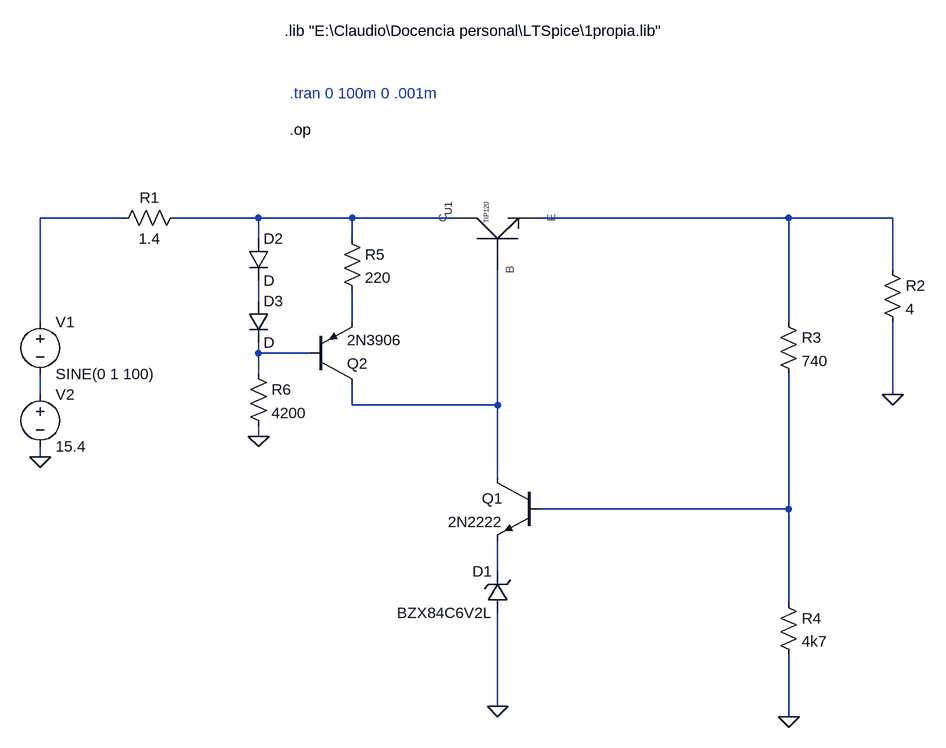
[diagram p0: schematic fuente clase 1_b.asc]
fuente clase 1_b.asc, the LTspice schematic file:
Version 4
SHEET 1 1284 1012
WIRE 16 224 -112 224
WIRE 224 224 96 224
WIRE 368 224 224 224
WIRE 528 224 368 224
WIRE 1040 224 656 224
WIRE 1200 224 1040 224
WIRE 224 256 224 224
WIRE 368 256 368 224
WIRE 1200 304 1200 224
WIRE 224 352 224 320
WIRE -112 384 -112 224
WIRE 368 384 368 336
WIRE 1040 384 1040 224
WIRE 224 432 224 416
WIRE 304 432 224 432
WIRE 224 464 224 432
WIRE -112 496 -112 464
WIRE 1200 496 1200 384
WIRE 368 512 368 480
WIRE 592 512 592 304
WIRE 592 512 368 512
WIRE 224 560 224 544
WIRE -112 592 -112 576
WIRE 592 624 592 512
WIRE 1040 672 1040 464
WIRE 1040 672 656 672
WIRE 592 768 592 720
WIRE 1040 816 1040 672
WIRE 592 976 592 832
WIRE 1040 992 1040 896
FLAG 592 976 0
FLAG -112 592 0
FLAG 1200 496 0
FLAG 1040 992 0
FLAG 224 560 0
DATAFLAG 976 224 ""
DATAFLAG 592 336 ""
DATAFLAG -80 224 ""
SYMBOL Propia\\Darlington\ npn 592 256 R270
SYMATTR Value TIP120
SYMATTR InstName U1
SYMBOL zener 608 832 R180
WINDOW 0 24 64 Left 2
WINDOW 3 24 0 Left 2
SYMATTR InstName D1
SYMATTR Value BZX84C6V2L
SYMBOL voltage -112 368 R0
WINDOW 123 0 0 Left 0
WINDOW 39 0 0 Left 0
SYMATTR InstName V1
SYMATTR Value SINE(0 1 100)
SYMBOL voltage -112 480 R0
WINDOW 123 0 0 Left 0
WINDOW 39 0 0 Left 0
SYMATTR InstName V2
SYMATTR Value 15.4
SYMBOL res 112 208 R90
WINDOW 0 0 56 VBottom 2
WINDOW 3 32 56 VTop 2
SYMATTR InstName R1
SYMATTR Value 1.4
SYMBOL res 1184 288 R0
SYMATTR InstName R2
SYMATTR Value 4
SYMBOL npn 656 624 M0
SYMATTR InstName Q1
SYMATTR Value 2N2222
SYMBOL res 1024 368 R0
SYMATTR InstName R3
SYMATTR Value 740
SYMBOL res 1024 800 R0
SYMATTR InstName R4
SYMATTR Value 4k7
SYMBOL pnp 304 480 M180
SYMATTR InstName Q2
SYMATTR Value 2N3906
SYMBOL res 352 240 R0
SYMATTR InstName R5
SYMATTR Value 220
SYMBOL diode 208 256 R0
SYMATTR InstName D2
SYMBOL diode 208 352 R0
SYMATTR InstName D3
SYMBOL res 208 448 R0
SYMATTR InstName R6
SYMATTR Value 4200
TEXT 272 32 Left 2 ;.tran 0 100m 0 .001m
TEXT 264 -64 Left 2 !.lib "E:\\Claudio\\Docencia personal\\LTSpice\\1propia.lib"
TEXT 272 88 Left 2 !.op

The netlist it stands for:
* fuente clase 1_b.asc
XU1 N002 N008 N003 TIP120  ; pins C B E
D1 0 N010 BZX84C6V2L
V1 N001 N007 SINE(0 1 100)
V2 N007 0 15.4
R1 N002 N001 1.4
R2 N003 0 4
Q1 N008 N009 N010 0 2N2222
R3 N003 N009 740
R4 N009 0 4k7
Q2 N008 N006 N005 0 2N3906
R5 N002 N005 220
D2 N002 N004 D
D3 N004 N006 D
R6 N006 0 4200
.model D D
.lib standard.dio
.model NPN NPN
.model PNP PNP
.lib standard.bjt
* .tran 0 100m 0 .001m
.lib "E:\Claudio\Docencia personal\LTSpice\1propia.lib"
.op
.backanno
.end